# Altium schematic sheet rs485.SchDoc
size A4; SheetNumber: 7; SheetTotal: 7
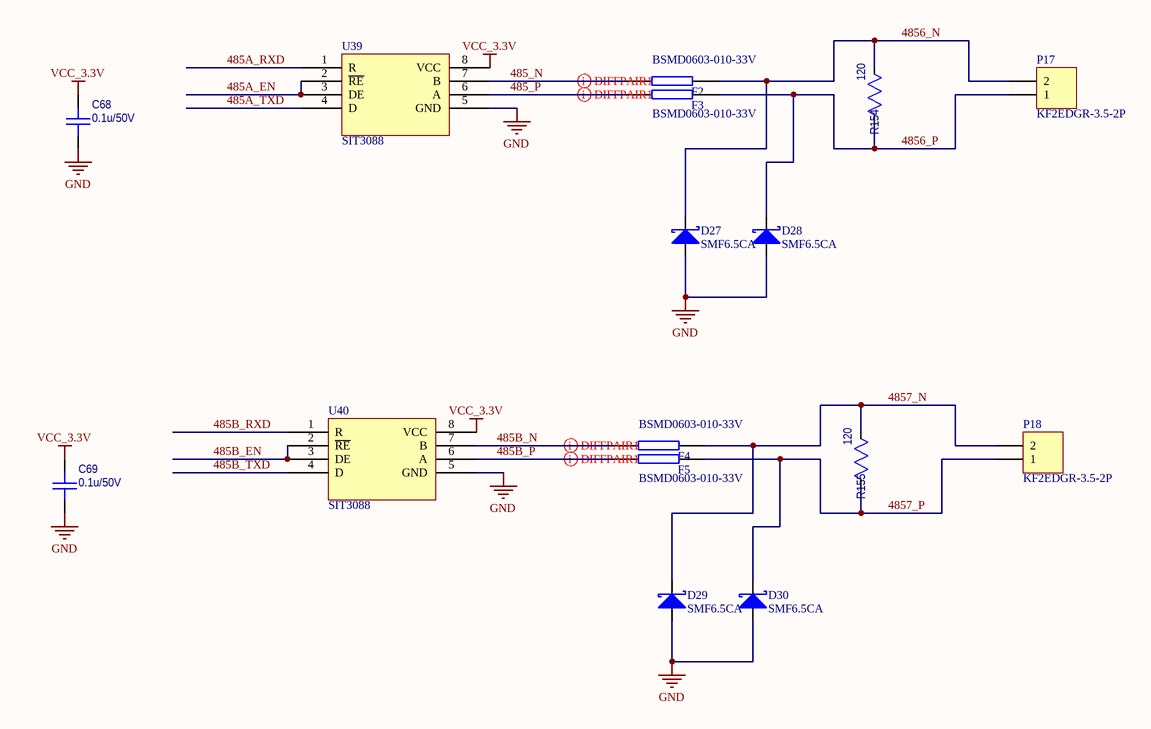
[diagram p0: rs485.SchDoc]

## Parts
C68  0.1u/50V  [CAPC1608X092N_0603]
C69  0.1u/50V  [CAPC1608X092N_0603]
D27  SMF6.5CA  [SOD123]
D28  SMF6.5CA  [SOD123]
D29  SMF6.5CA  [SOD123]
D30  SMF6.5CA  [SOD123]
F2  BSMD0603-010-33V  [0603R]
F3  BSMD0603-010-33V  [0603R]
F4  BSMD0603-010-33V  [0603R]
F5  BSMD0603-010-33V  [0603R]
P17  KF2EDGR-3.5-2P  [CONN-TH_P3.50_KF2EDGR-3.5-2P]
P18  KF2EDGR-3.5-2P  [CONN-TH_P3.50_KF2EDGR-3.5-2P]
R154  120  [RESC1608X055N_0603]  (no BOM)
R155  120  [RESC1608X055N_0603]  (no BOM)
U39  SIT3088  [so-8]
U40  SIT3088  [so-8]

## Nets
GND: C68.2 C69.2 D27.1(A) D28.1(A) D29.1(A) D30.1(A) U39.5(GND) U40.5(GND)
VCC_3.3V: C68.1 C69.1 U39.8(VCC) U40.8(VCC)
485_N: F2.2 U39.7(B)
485_P: F3.2 U39.6(A)
485A_EN: U39.2(~{RE}) U39.3(DE)
485A_RXD: U39.1(R)
485A_TXD: U39.4(D)
485B_EN: U40.2(~{RE}) U40.3(DE)
485B_N: F4.2 U40.7(B)
485B_P: F5.2 U40.6(A)
485B_RXD: U40.1(R)
485B_TXD: U40.4(D)
4856_N: D27.2(K) F2.1 P17.2 R154.1
4856_P: D28.2(K) F3.1 P17.1 R154.2
4857_N: D29.2(K) F4.1 P18.2 R155.1
4857_P: D30.2(K) F5.1 P18.1 R155.2

## Layout directives
differential pair: 485_N, 485_P, 485B_N, 485B_P

## Library data of the parts
C68 C69 = Capacitor_0603: Capacitor, MLCC; PartNumber: C0603C104M5RACTU; Voltage Rating: [voltage]; Package: 0603; Value: 0.1u/50V
D27-D30 = DIODE S: Value: SMBJ6.5A
F2-F5 = RES2
P17 P18 = Header 2: Header, 2-Pin
R154 R155 = Resistor_0603: Resistor, Standard; PartNumber: RC0603FR-1075KL; Package: 0603; Value: 120
U39 U40 = SN65HVD06D